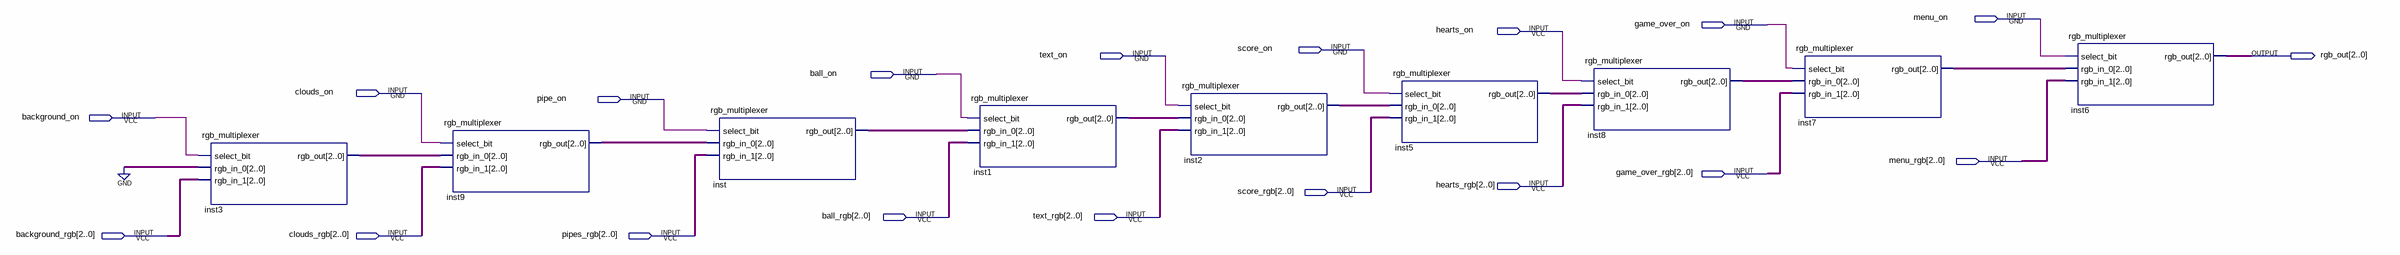
[diagram p0: schematic sheet]
// Quartus schematic rgb_output.bdf as structural Verilog: 9 symbols, 19 pins
module rgb_output (
  input  menu_on,
  input  game_over_on,
  input  hearts_on,
  input  score_on,
  input  text_on,
  input  ball_on,
  input  clouds_on,
  input  pipe_on,
  input  background_on,
  input  [2:0] menu_rgb,
  input  [2:0] game_over_rgb,
  input  [2:0] hearts_rgb,
  input  [2:0] score_rgb,
  input  [2:0] ball_rgb,
  input  [2:0] text_rgb,
  input  [2:0] background_rgb,
  input  [2:0] clouds_rgb,
  input  [2:0] pipes_rgb,
  output [2:0] rgb_out
);

  wire [2:0] inst1_rgb_out, inst2_rgb_out, inst3_rgb_out, inst5_rgb_out, inst7_rgb_out, inst8_rgb_out,
       inst9_rgb_out, inst_rgb_out;

  rgb_multiplexer inst3 (
    .select_bit(background_on), .rgb_in_0(3'b000), .rgb_in_1(background_rgb), .rgb_out(inst3_rgb_out));
  rgb_multiplexer inst9 (
    .select_bit(clouds_on), .rgb_in_0(inst3_rgb_out), .rgb_in_1(clouds_rgb), .rgb_out(inst9_rgb_out));
  rgb_multiplexer inst (.select_bit(pipe_on), .rgb_in_0(inst9_rgb_out), .rgb_in_1(pipes_rgb), .rgb_out(inst_rgb_out));
  rgb_multiplexer inst1 (.select_bit(ball_on), .rgb_in_0(inst_rgb_out), .rgb_in_1(ball_rgb), .rgb_out(inst1_rgb_out));
  rgb_multiplexer inst2 (.select_bit(text_on), .rgb_in_0(inst1_rgb_out), .rgb_in_1(text_rgb), .rgb_out(inst2_rgb_out));
  rgb_multiplexer inst5 (
    .select_bit(score_on), .rgb_in_0(inst2_rgb_out), .rgb_in_1(score_rgb), .rgb_out(inst5_rgb_out));
  rgb_multiplexer inst8 (
    .select_bit(hearts_on), .rgb_in_0(inst5_rgb_out), .rgb_in_1(hearts_rgb), .rgb_out(inst8_rgb_out));
  rgb_multiplexer inst7 (
    .select_bit(game_over_on), .rgb_in_0(inst8_rgb_out), .rgb_in_1(game_over_rgb), .rgb_out(inst7_rgb_out));
  rgb_multiplexer inst6 (.select_bit(menu_on), .rgb_in_0(inst7_rgb_out), .rgb_in_1(menu_rgb), .rgb_out(rgb_out));
endmodule
